# EAGLE schematic stepper-shield (EAGLE 4.16)
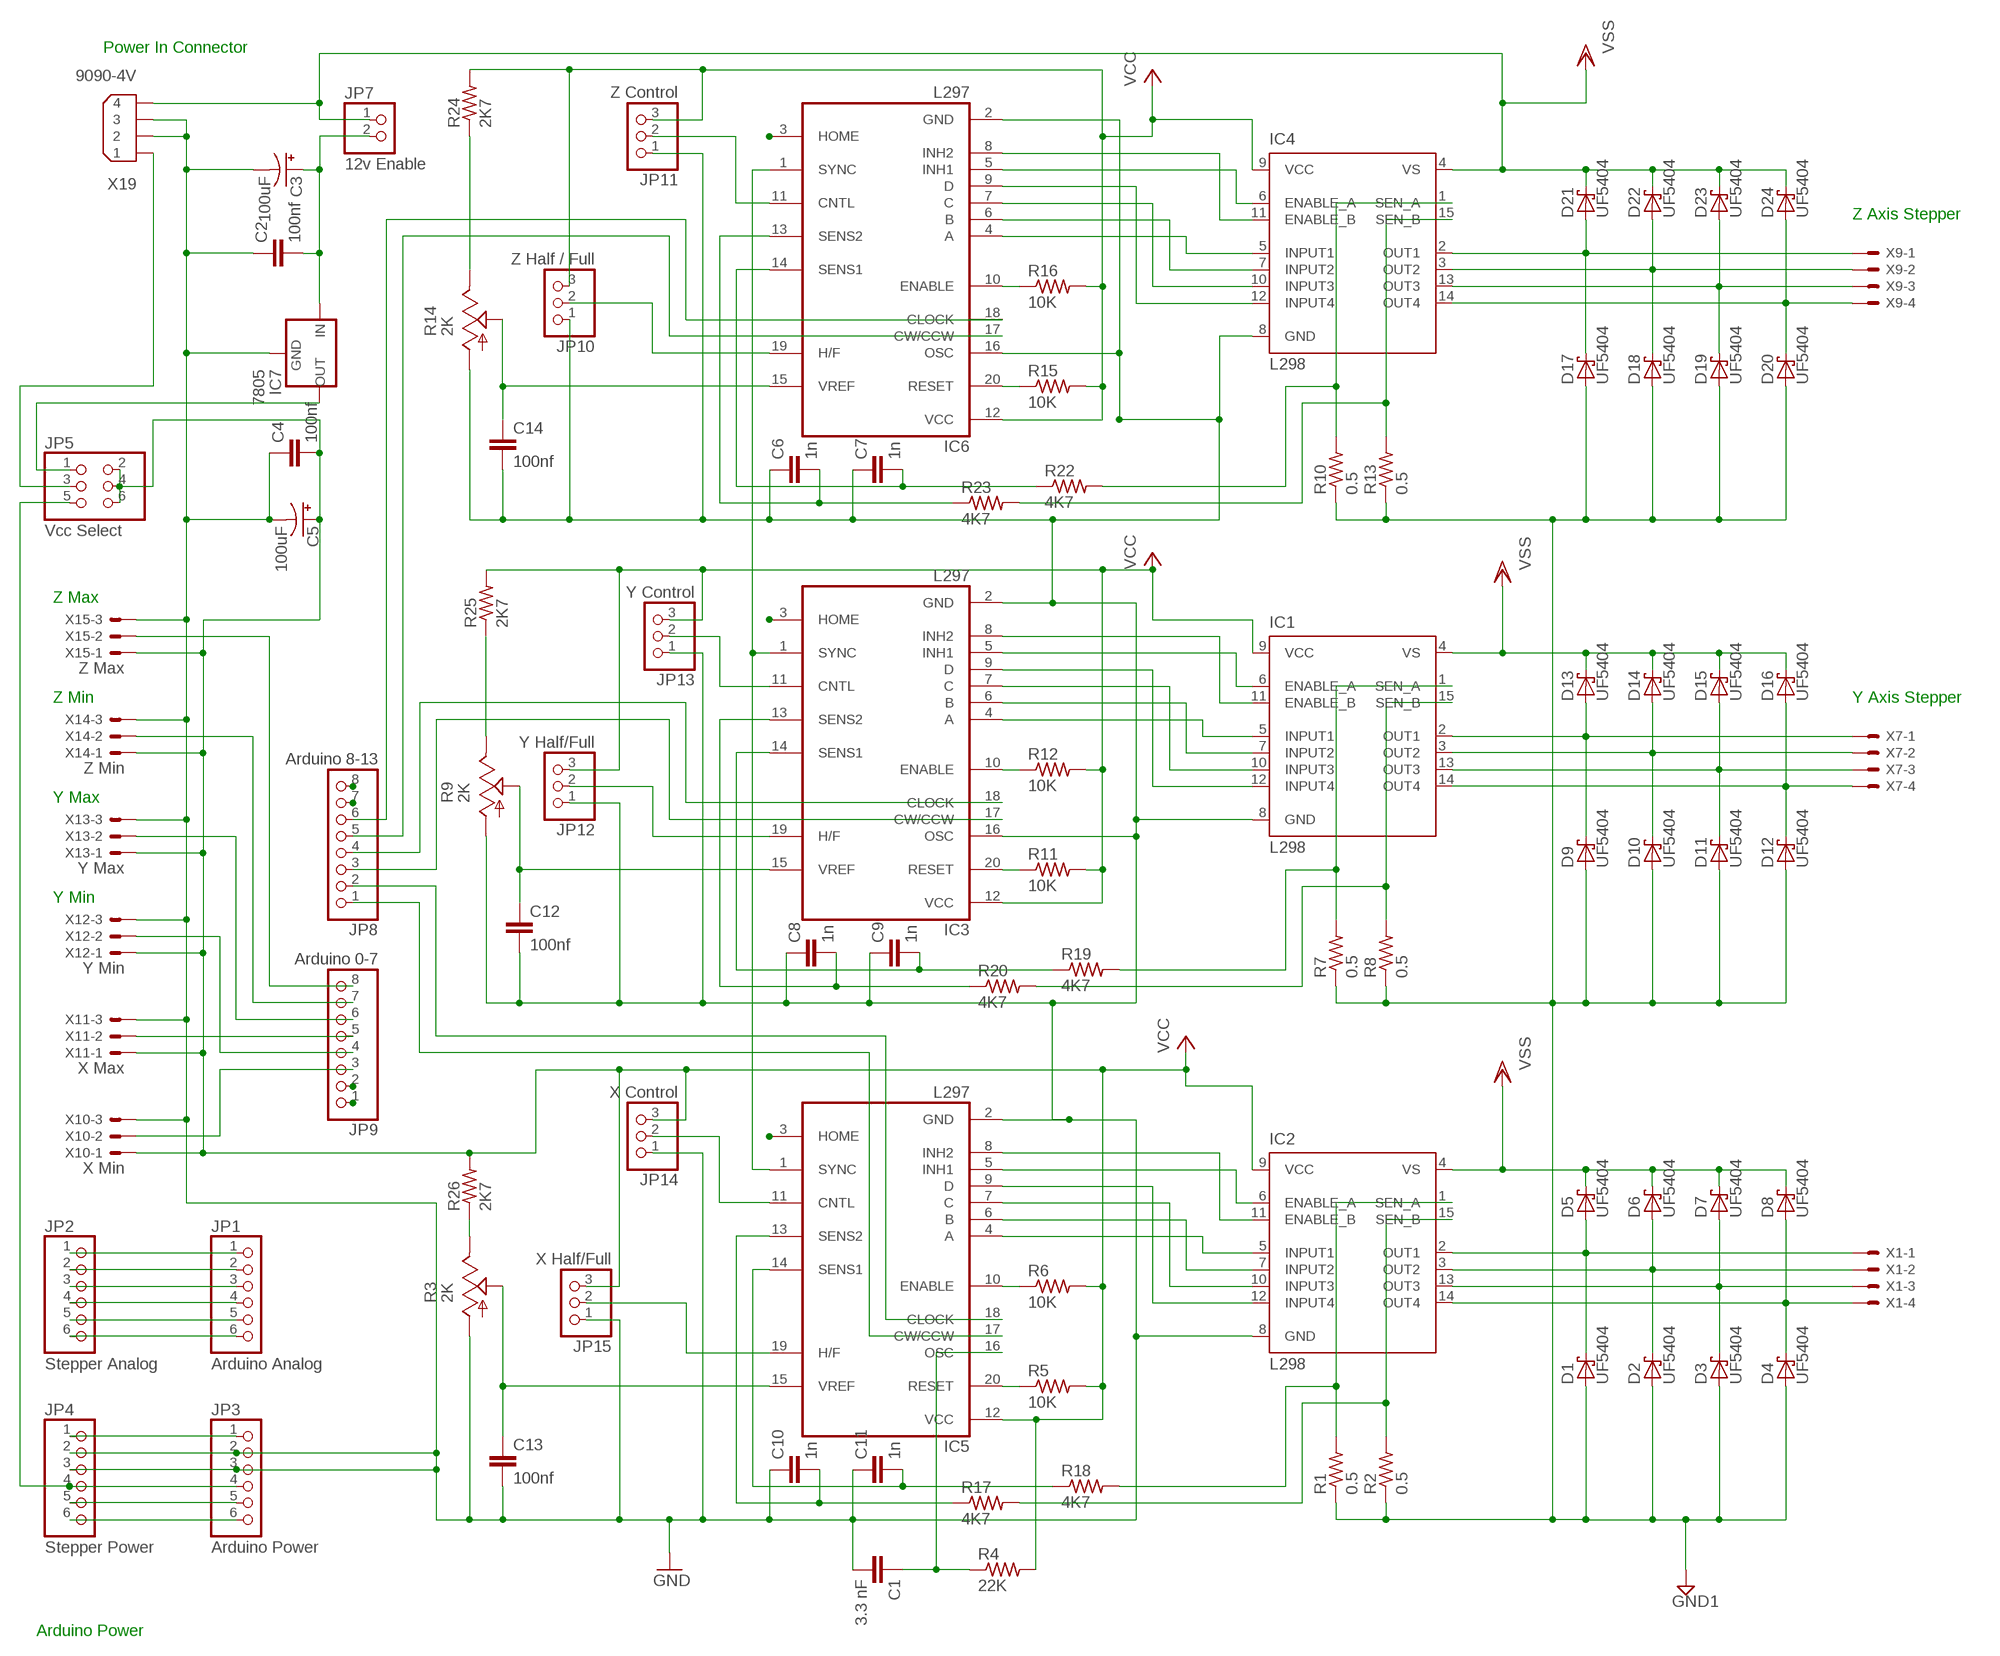
[diagram p0: schematic, sheet 1]

## Parts
C1  3.3 nF  C5/3.5  [C5B3.5]
C2  100nf  C-EU050-025X075  [C050-025X075]
C3  100uF  CPOL-USE5-6  [E5-6]
C4  100nf  C-EU050-025X075  [C050-025X075]
C5  100uF  CPOL-USE5-6  [E5-6]
C6  1n  C-EU050-030X075  [C050-030X075]
C7  1n  C-EU050-030X075  [C050-030X075]
C8  1n  C-EU050-030X075  [C050-030X075]
C9  1n  C-EU050-030X075  [C050-030X075]
C10  1n  C-EU050-030X075  [C050-030X075]
C11  1n  C-EU050-030X075  [C050-030X075]
C12  100nf  C-EU050-035X075  [C050-035X075]
C13  100nf  C-EU050-035X075  [C050-035X075]
C14  100nf  C-EU050-035X075  [C050-035X075]
D1  UF5404  SCHOTTKY-DIODECB429-15  [CB429-15]
D2  UF5404  SCHOTTKY-DIODECB429-15  [CB429-15]
D3  UF5404  SCHOTTKY-DIODECB429-15  [CB429-15]
D4  UF5404  SCHOTTKY-DIODECB429-15  [CB429-15]
D5  UF5404  SCHOTTKY-DIODECB429-15  [CB429-15]
D6  UF5404  SCHOTTKY-DIODECB429-15  [CB429-15]
D7  UF5404  SCHOTTKY-DIODECB429-15  [CB429-15]
D8  UF5404  SCHOTTKY-DIODECB429-15  [CB429-15]
D9  UF5404  SCHOTTKY-DIODECB429-15  [CB429-15]
D10  UF5404  SCHOTTKY-DIODECB429-15  [CB429-15]
D11  UF5404  SCHOTTKY-DIODECB429-15  [CB429-15]
D12  UF5404  SCHOTTKY-DIODECB429-15  [CB429-15]
D13  UF5404  SCHOTTKY-DIODECB429-15  [CB429-15]
D14  UF5404  SCHOTTKY-DIODECB429-15  [CB429-15]
D15  UF5404  SCHOTTKY-DIODECB429-15  [CB429-15]
D16  UF5404  SCHOTTKY-DIODECB429-15  [CB429-15]
D17  UF5404  SCHOTTKY-DIODECB429-15  [CB429-15]
D18  UF5404  SCHOTTKY-DIODECB429-15  [CB429-15]
D19  UF5404  SCHOTTKY-DIODECB429-15  [CB429-15]
D20  UF5404  SCHOTTKY-DIODECB429-15  [CB429-15]
D21  UF5404  SCHOTTKY-DIODECB429-15  [CB429-15]
D22  UF5404  SCHOTTKY-DIODECB429-15  [CB429-15]
D23  UF5404  SCHOTTKY-DIODECB429-15  [CB429-15]
D24  UF5404  SCHOTTKY-DIODECB429-15  [CB429-15]
IC1  L298  [MULTIWATT-15]
IC2  L298  [MULTIWATT-15]
IC3  L297  [DIL20]
IC4  L298  [MULTIWATT-15]
IC5  L297  [DIL20]
IC6  L297  [DIL20]
IC7  7805  78XXS  [78XXS]
JP1  Arduino Analog  PINHD-1X6  [1X06]
JP2  Stepper Analog  PINHD-1X6  [1X06]
JP3  Arduino Power  PINHD-1X6  [1X06]
JP4  Stepper Power  PINHD-1X6  [1X06]
JP5  Vcc Select  PINHD-2X3  [2X03]
JP7  12v Enable  PINHD-1X2  [1X02]
JP8  Arduino 8-13  PINHD-1X8  [1X08]
JP9  Arduino 0-7  PINHD-1X8  [1X08]
JP10  Z Half / Full  PINHD-1X3  [1X03]
JP11  Z Control  PINHD-1X3  [1X03]
JP12  Y Half/Full  PINHD-1X3  [1X03]
JP13  Y Control  PINHD-1X3  [1X03]
JP14  X Control  PINHD-1X3  [1X03]
JP15  X Half/Full  PINHD-1X3  [1X03]
R1  0.5  R-US_0309/12  [0309/12]
R2  0.5  R-US_0309/12  [0309/12]
R3  2K  TRIM_US-B25U  [B25U]
R4  22K  R-US_0204/7  [0204/7]
R5  10K  R-US_0207/10  [0207/10]
R6  10K  R-US_0207/10  [0207/10]
R7  0.5  R-US_0309/12  [0309/12]
R8  0.5  R-US_0309/12  [0309/12]
R9  2K  TRIM_US-B25U  [B25U]
R10  0.5  R-US_0309/12  [0309/12]
R11  10K  R-US_0207/10  [0207/10]
R12  10K  R-US_0207/10  [0207/10]
R13  0.5  R-US_0309/12  [0309/12]
R14  2K  TRIM_US-B25U  [B25U]
R15  10K  R-US_0207/10  [0207/10]
R16  10K  R-US_0207/10  [0207/10]
R17  4K7  R-US_0207/7  [0207/7]
R18  4K7  R-US_0207/7  [0207/7]
R19  4K7  R-US_0207/7  [0207/7]
R20  4K7  R-US_0207/7  [0207/7]
R22  4K7  R-US_0207/7  [0207/7]
R23  4K7  R-US_0207/7  [0207/7]
R24  2K7  R-US_0207/7  [0207/7]
R25  2K7  R-US_0207/7  [0207/7]
R26  2K7  R-US_0207/7  [0207/7]
X1  KK-156-4  [KK-156-4]
X7  KK-156-4  [KK-156-4]
X9  KK-156-4  [KK-156-4]
X10  X Min  22-23-2031  [22-23-2031]
X11  X Max  22-23-2031  [22-23-2031]
X12  Y Min  22-23-2031  [22-23-2031]
X13  Y Max  22-23-2031  [22-23-2031]
X14  Z Min  22-23-2031  [22-23-2031]
X15  Z Max  22-23-2031  [22-23-2031]
X19  9090-4V  [9090-4V]

## Nets
GND [Ground]: C1.2 C2.1 C3.- C4.1 C5.- C6.1 C7.1 C8.1 C9.1 C10.1 C11.1 C12.2 C13.2 C14.2 IC1.8(GND) IC2.8(GND) IC3.2(GND) IC3.16(OSC) IC4.8(GND) IC5.2(GND) IC6.2(GND) IC6.16(OSC) IC7.GND JP3.2 JP3.3 JP4.2 JP4.3 JP10.1 JP11.1 JP12.1 JP13.1 JP14.1 JP15.1 R3.A R9.A R14.A X10.3 X11.3 X12.3 X13.3 X14.3 X15.3 X19.2 X19.3
GND1 [Power]: D1.A D2.A D3.A D4.A D9.A D10.A D11.A D12.A D17.A D18.A D19.A D20.A R1.1 R2.1 R7.1 R8.1 R10.1 R13.1
N$1: IC2.11(ENABLE_B) IC5.8(INH2)
N$2: IC2.6(ENABLE_A) IC5.5(INH1)
N$3: IC2.12(INPUT4) IC5.9(D)
N$4: IC2.10(INPUT3) IC5.7(C)
N$5: IC2.7(INPUT2) IC5.6(B)
N$6: IC2.5(INPUT1) IC5.4(A)
N$7: C1.1 IC5.16(OSC) R4.1
N$8: C11.2 IC5.14(SENS1) R18.1
N$9: IC2.15(SEN_B) R2.2 R17.2
N$10: IC5.17(CW/CCW) JP8.1
N$11: IC5.18(CLOCK) JP8.2
N$12: IC2.1(SEN_A) R1.2 R18.2
N$13 [Power]: D4.C D8.A IC2.14(OUT4) X1.4
N$14: IC5.10(ENABLE) R6.1
N$15: IC5.20(RESET) R5.1
N$16: IC1.11(ENABLE_B) IC3.8(INH2)
N$17: IC1.6(ENABLE_A) IC3.5(INH1)
N$18: IC5.19(H/F) JP15.2
N$19: IC1.12(INPUT4) IC3.9(D)
N$20 [Power]: D3.C D7.A IC2.13(OUT3) X1.3
N$21: R3.E R26.1
N$22 [Power]: D2.C D6.A IC2.3(OUT2) X1.2
N$23: IC1.10(INPUT3) IC3.7(C)
N$24: IC1.7(INPUT2) IC3.6(B)
N$25: IC1.5(INPUT1) IC3.4(A)
N$26: C9.2 IC3.14(SENS1) R19.1
N$27: C8.2 IC3.13(SENS2) R20.1
N$28: IC3.19(H/F) JP12.2
N$29: C12.1 IC3.15(VREF) R9.S
N$30: IC3.17(CW/CCW) JP8.3
N$31: IC3.18(CLOCK) JP8.4
N$32: IC3.1(SYNC) IC5.1(SYNC) IC6.1(SYNC)
N$33 [Power]: D9.C D13.A IC1.2(OUT1) X7.1
N$34 [Power]: D10.C D14.A IC1.3(OUT2) X7.2
N$35 [Power]: D11.C D15.A IC1.13(OUT3) X7.3
N$36 [Power]: D12.C D16.A IC1.14(OUT4) X7.4
N$37: IC3.10(ENABLE) R12.1
N$38: IC3.20(RESET) R11.1
N$39: IC4.12(INPUT4) IC6.9(D)
N$40: IC4.10(INPUT3) IC6.7(C)
N$41: IC4.7(INPUT2) IC6.6(B)
N$42: IC4.5(INPUT1) IC6.4(A)
N$43: IC4.11(ENABLE_B) IC6.8(INH2)
N$44: IC4.6(ENABLE_A) IC6.5(INH1)
N$45: C7.2 IC6.14(SENS1) R22.1
N$46: C6.2 IC6.13(SENS2) R23.1
N$47: IC6.19(H/F) JP10.2
N$48: C14.1 IC6.15(VREF) R14.S
N$49 [Power]: D17.C D21.A IC4.2(OUT1) X9.1
N$50 [Power]: D18.C D22.A IC4.3(OUT2) X9.2
N$51 [Power]: D19.C D23.A IC4.13(OUT3) X9.3
N$52 [Power]: D20.C D24.A IC4.14(OUT4) X9.4
N$53: IC6.20(RESET) R15.1
N$54: IC6.10(ENABLE) R16.1
N$55: IC6.17(CW/CCW) JP8.5
N$56: IC6.18(CLOCK) JP8.6
N$57: JP5.3 X19.1
N$58: IC7.OUT JP5.1
N$59: JP9.1
N$60: JP9.4 X12.2
N$61: JP9.5 X11.2
N$62: JP9.6 X13.2
N$63: JP9.2
N$64: JP1.1 JP2.1
N$65: JP1.2 JP2.2
N$66: JP1.3 JP2.3
N$67: JP1.4 JP2.4
N$68: JP1.5 JP2.5
N$69: JP8.8
N$70: JP1.6 JP2.6
N$71: JP3.1 JP4.1
N$72: IC4.15(SEN_B) R13.2 R23.2
N$73: IC4.1(SEN_A) R10.2 R22.2
N$74: IC3.11(CNTL) JP13.2
N$75 [Power]: D1.C D5.A IC2.2(OUT1) X1.1
N$76: C10.2 IC5.13(SENS2) R17.1
N$77: C13.1 IC5.15(VREF) R3.S
N$78: IC5.11(CNTL) JP14.2
N$79: C2.2 C3.+ IC7.IN JP7.2
N$80: R9.E R25.1
N$81: R14.E R24.1
N$82: JP8.7
N$83: IC1.15(SEN_B) R8.2 R20.2
N$84: IC6.11(CNTL) JP11.2
N$85: JP9.7 X14.2
N$86: JP9.8 X15.2
N$87: JP9.3 X10.2
N$88: JP3.4 JP4.4 JP5.5
N$89: JP3.5 JP4.5
N$92: IC3.3(HOME)
N$95: IC5.3(HOME)
N$96: IC6.3(HOME)
N$97: IC1.1(SEN_A) R7.2 R19.2
N$98: JP3.6 JP4.6
VCC: C4.2 C5.+ IC1.9(VCC) IC2.9(VCC) IC3.12(VCC) IC4.9(VCC) IC5.12(VCC) IC6.12(VCC) JP5.2 JP5.4 JP5.6 JP10.3 JP11.3 JP12.3 JP13.3 JP14.3 JP15.3 R4.2 R5.2 R6.2 R11.2 R12.2 R15.2 R16.2 R24.2 R25.2 R26.2 X10.1 X11.1 X12.1 X13.1 X14.1 X15.1
VSS [Power]: D5.C D6.C D7.C D8.C D13.C D14.C D15.C D16.C D21.C D22.C D23.C D24.C IC1.4(VS) IC2.4(VS) IC4.4(VS) JP7.1 X19.4

## Notes on the sheet
- Power In Connector
- Z Axis Stepper
- Z Max
- Z Min | Y Axis Stepper
- Y Max
- Y Min
- Arduino Power

## Library data of the parts
C1 = capacitor-wima:C: CAPACITOR naming: grid - package width
C2 C4 C6-C14 = rcl:C-EU: CAPACITOR, European symbol
C3 C5 = rcl:CPOL-US: POLARIZED CAPACITOR, American symbol
D1-D24 = diode:SCHOTTKY-DIODE: Schottky Diode
IC1 IC2 IC4 = st-microelectronics:L298: DUAL FULL-BRIDGE DRIVER
IC3 IC5 IC6 = st-microelectronics:L297: STEPPER MOTOR CONTROLLER
IC7 = cls:78XXS: VOLTAGE REGULATOR
JP1-JP4 = pinhead:PINHD-1X6: PIN HEADER
JP5 = pinhead:PINHD-2X3: PIN HEADER
JP7 = pinhead:PINHD-1X2: PIN HEADER
JP8 JP9 = pinhead:PINHD-1X8: PIN HEADER
JP10-JP15 = pinhead:PINHD-1X3: PIN HEADER
R1 R2 R4-R8 R10-R13 R15-R20 R22-R26 = rcl:R-US_: RESISTOR, American symbol
R3 R9 R14 = pot:TRIM_US-: POTENTIOMETER
X1 X7 X9 = con-molex:KK-156-4: KK 156 HEADER Source: http://www.molex.com/pdm_docs/sd/026604100_sd.pdf
X10-X15 = con-molex:22-23-2031: .100" (2.54mm) Center Header - 3 Pin
X19 = con-thomas-betts:9090-4: Disk Drive Power four position Source: Thomas & Betts Electronic Interconnects Eiropean Edition 1998

## Net classes
1 Power: width 1.524 mm, drill 0.381 mm
2 Signal: width 0.508 mm, drill 0.381 mm
3 Ground: width 0.762 mm, drill 0.381 mm